# Altium schematic sheet Balancing.SchDoc
size A4; SheetNumber: 1; SheetTotal: 1
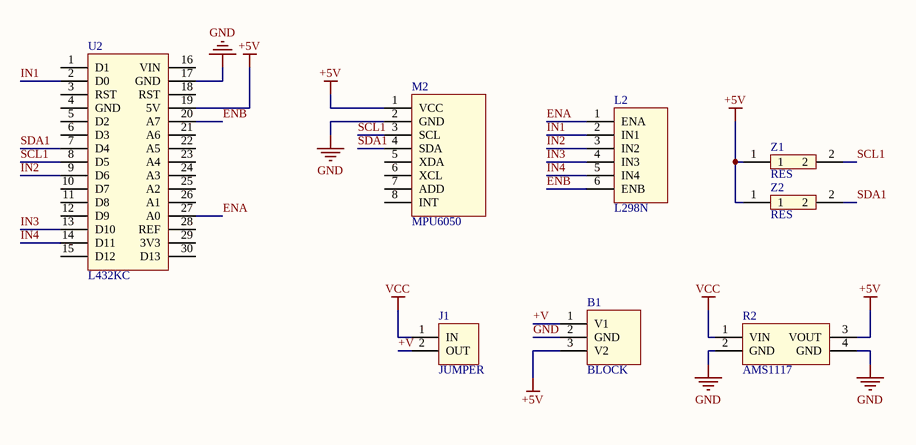
[diagram p0: Balancing.SchDoc]

## Parts
B1  BLOCK  [BLOCK]
J1  JUMPER  [JUMPER]
L2  L298N  [L298N]
M2  MPU6050  [MPU6050]
R2  AMS1117  [AMS1117]
U2  L432KC  [L432KC]
Z1  RES  [RES]
Z2  RES  [RES]

## Nets
+5V: B1.3(V2) M2.1(VCC) R2.3(VOUT) U2.19(5V) Z1.1 Z2.1
GND: B1.2(GND) M2.2(GND) R2.2(GND) R2.4(GND) U2.17(GND)
VCC: J1.1(IN) R2.1(VIN)
+V: B1.1(V1) J1.2(OUT)
ENA: L2.1(ENA) U2.27(A0)
ENB: L2.6(ENB) U2.20(A7)
IN1: L2.2(IN1) U2.2(D0)
IN2: L2.3(IN2) U2.9(D6)
IN3: L2.4(IN3) U2.13(D10)
IN4: L2.5(IN4) U2.14(D11)
SCL1: M2.3(SCL) U2.8(D5) Z1.2
SDA1: M2.4(SDA) U2.7(D4) Z2.2

Not connected (* = marked no-connect by the designer): M2 5(XDA) 6(XCL) 7(ADD) 8(INT); U2 1(D1) 3(RST) 4(GND) 5(D2) 6(D3) 10(D7) 11(D8) 12(D9) 15(D12) 16(VIN) 18(RST) 21(A6) 22(A5) 23(A4) 24(A3) 25(A2) 26(A1) 28(REF) 29(3V3) 30(D13)